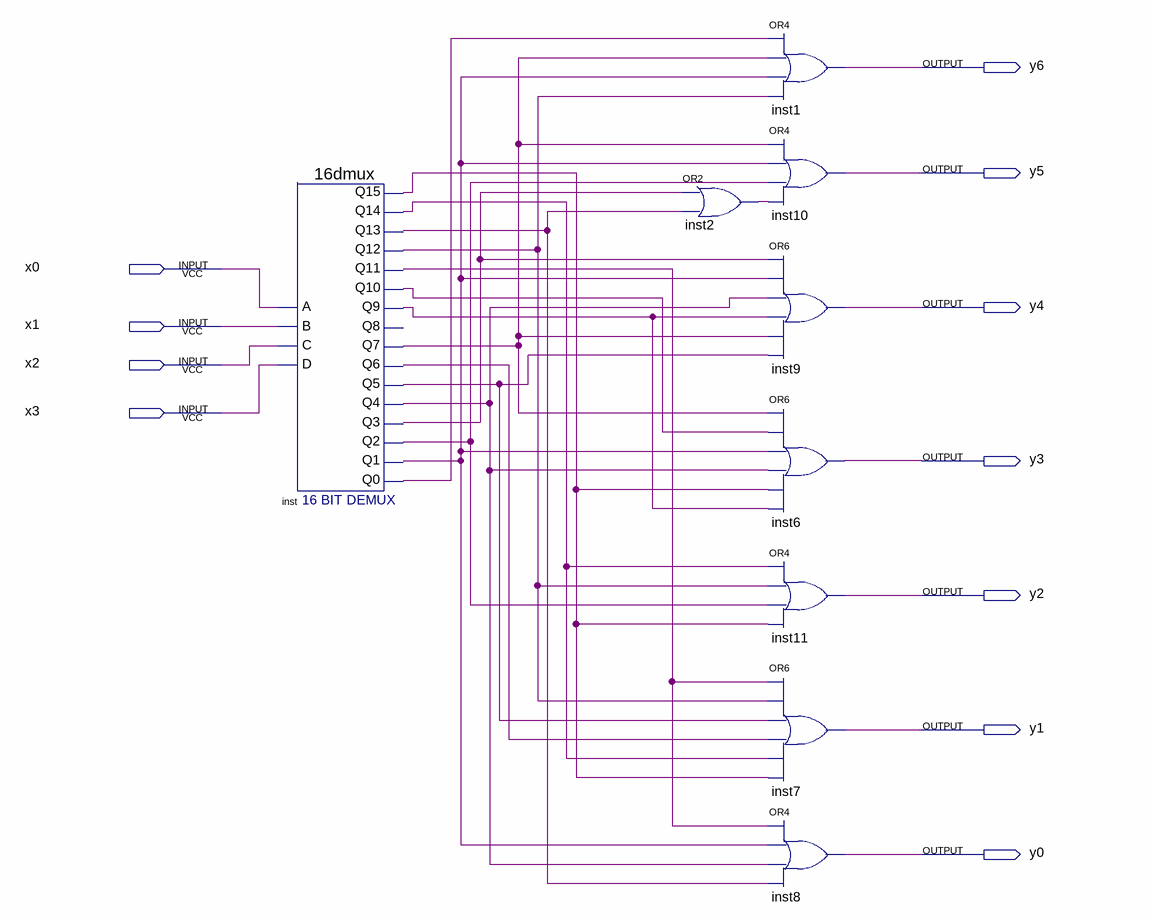
[diagram p0: schematic sheet]
// Quartus schematic conv_7seg.bdf as structural Verilog: 9 symbols, 11 pins
module conv_7seg (
  input  x0,
  input  x1,
  input  x2,
  input  x3,
  output y6,
  output y5,
  output y4,
  output y3,
  output y2,
  output y1,
  output y0
);

  wire inst2_out, inst_q0, inst_q1, inst_q2, inst_q3, inst_q4, inst_q5, inst_q6, inst_q7, inst_q9, inst_q10,
       inst_q11, inst_q12, inst_q13, inst_q14, inst_q15;

  \16dmux  inst (
    .C(x2), .B(x1), .A(x0), .D(x3), .Q12(inst_q12), .Q13(inst_q13), .Q11(inst_q11), .Q9(inst_q9),
    .Q10(inst_q10), .Q7(inst_q7), .Q4(inst_q4), .Q5(inst_q5), .Q6(inst_q6), .Q2(inst_q2), .Q3(inst_q3),
    .Q14(inst_q14), .Q15(inst_q15), .Q0(inst_q0), .Q1(inst_q1));  // open: Q8
  or inst2 (inst2_out, inst_q3, inst_q13);
  or inst1 (y6, inst_q0, inst_q7, inst_q1, inst_q12);
  or inst10 (y5, inst_q7, inst_q1, inst_q2, inst2_out);
  or inst9 (y4, inst_q3, inst_q1, inst_q4, inst_q9, inst_q7, inst_q5);
  or inst6 (y3, inst_q7, inst_q10, inst_q1, inst_q4, inst_q15, inst_q9);
  or inst11 (y2, inst_q14, inst_q12, inst_q2, inst_q15);
  or inst7 (y1, inst_q11, inst_q12, inst_q5, inst_q6, inst_q14, inst_q15);
  or inst8 (y0, inst_q11, inst_q1, inst_q4, inst_q13);
endmodule
